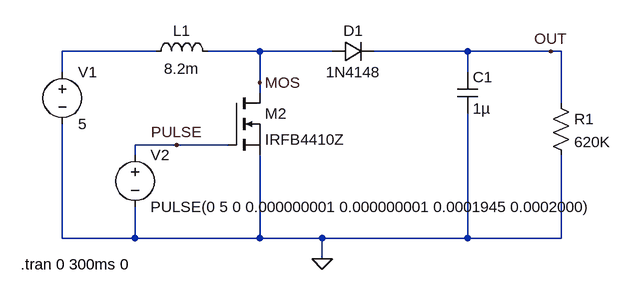
[diagram p0: schematic BOOST_CONVERTER.asc]
BOOST_CONVERTER.asc, the LTspice schematic file:
Version 4
SHEET 1 880 680
WIRE 32 208 -112 208
WIRE 192 208 112 208
WIRE 304 208 192 208
WIRE 512 208 368 208
WIRE 640 208 512 208
WIRE 656 208 640 208
WIRE -112 240 -112 208
WIRE 512 240 512 208
WIRE 192 256 192 208
WIRE 192 272 192 256
WIRE 656 288 656 208
WIRE 64 352 0 352
WIRE 144 352 64 352
WIRE 0 368 0 352
WIRE -112 496 -112 320
WIRE 0 496 0 448
WIRE 0 496 -112 496
WIRE 192 496 192 368
WIRE 192 496 0 496
WIRE 288 496 192 496
WIRE 512 496 512 304
WIRE 512 496 288 496
WIRE 656 496 656 368
WIRE 656 496 512 496
WIRE 288 528 288 496
FLAG 288 528 0
FLAG 640 208 OUT
FLAG 64 352 PULSE
FLAG 192 256 MOS
SYMBOL ind 16 224 R270
WINDOW 0 32 56 VTop 2
WINDOW 3 5 56 VBottom 2
SYMATTR InstName L1
SYMATTR Value 8.2m
SYMATTR SpiceLine Ipk=311m Rser=5.5556 Rpar=772.44K Cpar=0 mfg="Coilcraft" pn="PCH-45X-825"
SYMBOL voltage -112 224 R0
SYMATTR InstName V1
SYMATTR Value 5
SYMBOL voltage 0 352 R0
WINDOW 123 0 0 Left 2
WINDOW 39 0 0 Left 2
SYMATTR InstName V2
SYMATTR Value PULSE(0 5 0 0.000000001 0.000000001 0.0001945 0.0002000)
SYMBOL diode 304 224 R270
WINDOW 0 32 32 VTop 2
WINDOW 3 0 32 VBottom 2
SYMATTR InstName D1
SYMATTR Value 1N4148
SYMATTR Description Schottky diode
SYMATTR Type schottky
SYMBOL cap 496 240 R0
SYMATTR InstName C1
SYMATTR Value 1µ
SYMATTR SpiceLine Rser=20.3m Lser=0 mfg="KEMET" pn="C1210C105K5RAC" type="X7R"
SYMBOL res 640 272 R0
SYMATTR InstName R1
SYMATTR Value 620K
SYMBOL nmos 144 272 R0
SYMATTR InstName M2
SYMATTR Value IRFB4410Z
TEXT -176 536 Left 2 !.tran 0 300ms 0

The netlist it stands for:
* BOOST_CONVERTER.asc
L1 N001 MOS 8.2m Ipk=311m Rser=5.5556 Rpar=772.44K Cpar=0 mfg="Coilcraft" pn="PCH-45X-825"
V1 N001 0 5
V2 PULSE 0 PULSE(0 5 0 0.000000001 0.000000001 0.0001945 0.0002000)
D1 MOS OUT 1N4148
C1 OUT 0 1µ Rser=20.3m Lser=0 mfg="KEMET" pn="C1210C105K5RAC" type="X7R"
R1 OUT 0 620K
M2 MOS PULSE 0 0 IRFB4410Z
.model D D
.lib standard.dio
.model NMOS NMOS
.model PMOS PMOS
.lib standard.mos
.tran 0 300ms 0
.backanno
.end